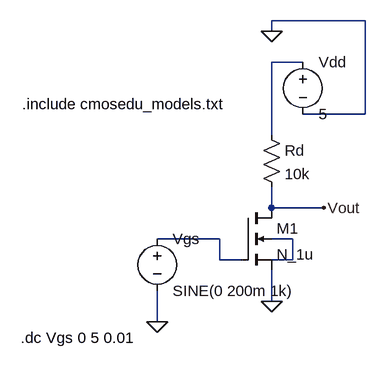
[diagram p0: schematic Parte3.asc]
Parte3.asc, the LTspice schematic file:
Version 4
SHEET 1 880 680
WIRE 288 -160 144 -160
WIRE 144 -144 144 -160
WIRE 192 -96 144 -96
WIRE 288 -16 288 -160
WIRE 288 -16 192 -16
WIRE 144 16 144 -96
WIRE 144 128 144 96
WIRE 224 128 144 128
WIRE 64 176 -32 176
WIRE 176 176 144 176
WIRE 64 208 64 176
WIRE 96 208 64 208
WIRE 176 208 176 176
WIRE 176 208 144 208
WIRE 144 272 144 224
WIRE -32 304 -32 256
FLAG -32 304 0
FLAG 144 272 0
FLAG 144 -144 0
FLAG 224 128 Vout
SYMBOL nmos4 96 128 R0
SYMATTR InstName M1
SYMATTR Value N_1u
SYMATTR Value2 l=1.5u w=9.23u
SYMBOL res 128 0 R0
SYMATTR InstName Rd
SYMATTR Value 10k
SYMBOL voltage 192 -112 R0
SYMATTR InstName Vdd
SYMATTR Value 5
SYMBOL voltage -32 160 R0
WINDOW 123 0 0 Left 2
WINDOW 39 0 0 Left 2
SYMATTR InstName Vgs
SYMATTR Value SINE(0 200m 1k)
TEXT -240 -32 Left 2 !.include cmosedu_models.txt
TEXT -242 328 Left 2 !.dc Vgs 0 5 0.01

The netlist it stands for:
* Parte3.asc
M1 Vout N002 0 N003 N_1u l=1.5u w=9.23u
Rd N001 Vout 10k
Vdd N001 0 5
Vgs N002 0 SINE(0 200m 1k)
.model NMOS NMOS
.model PMOS PMOS
.lib standard.mos
.include cmosedu_models.txt
.dc Vgs 0 5 0.01
.backanno
.end